# Altium schematic sheet Top.SchDoc
size A; SheetNumber: 1; SheetTotal: 4
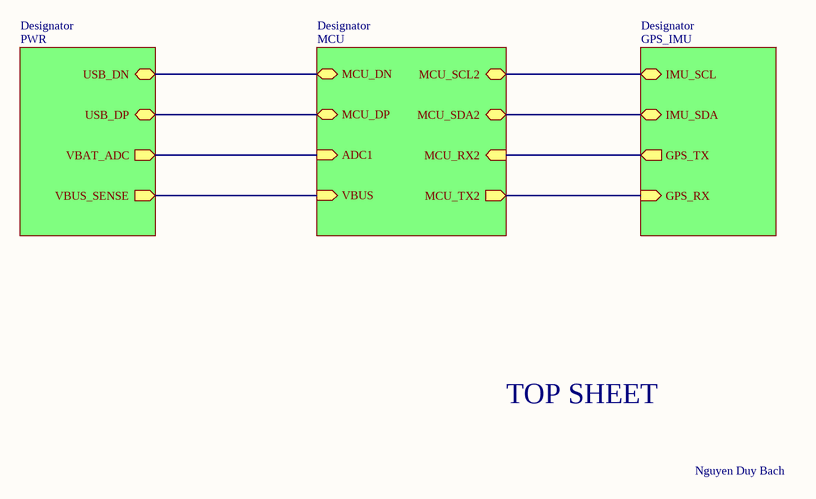
[diagram p0: Top.SchDoc]

## Sub-sheets
Designator = PWR: VBAT_ADC (out), VBUS_SENSE (out), USB_DP (bidir), USB_DN (bidir)
Designator = MCU: MCU_DN (bidir), MCU_DP (bidir), ADC1 (in), VBUS (in), MCU_SDA2 (bidir), MCU_SCL2 (bidir), MCU_TX2 (out), MCU_RX2 (in)
Designator = GPS_IMU: IMU_SCL (bidir), IMU_SDA (bidir), GPS_TX (out), GPS_RX (in)

## Nets
(unnamed): sheet Designator/VBAT_ADC, sheet Designator/ADC1
(unnamed): sheet Designator/VBUS_SENSE, sheet Designator/VBUS
(unnamed): sheet Designator/USB_DP, sheet Designator/MCU_DP
(unnamed): sheet Designator/USB_DN, sheet Designator/MCU_DN
(unnamed): sheet Designator/MCU_SDA2, sheet Designator/IMU_SDA
(unnamed): sheet Designator/MCU_SCL2, sheet Designator/IMU_SCL
(unnamed): sheet Designator/MCU_TX2, sheet Designator/GPS_RX
(unnamed): sheet Designator/MCU_RX2, sheet Designator/GPS_TX

## Notes on the sheet
- TOP SHEET
- Nguyen Duy Bach